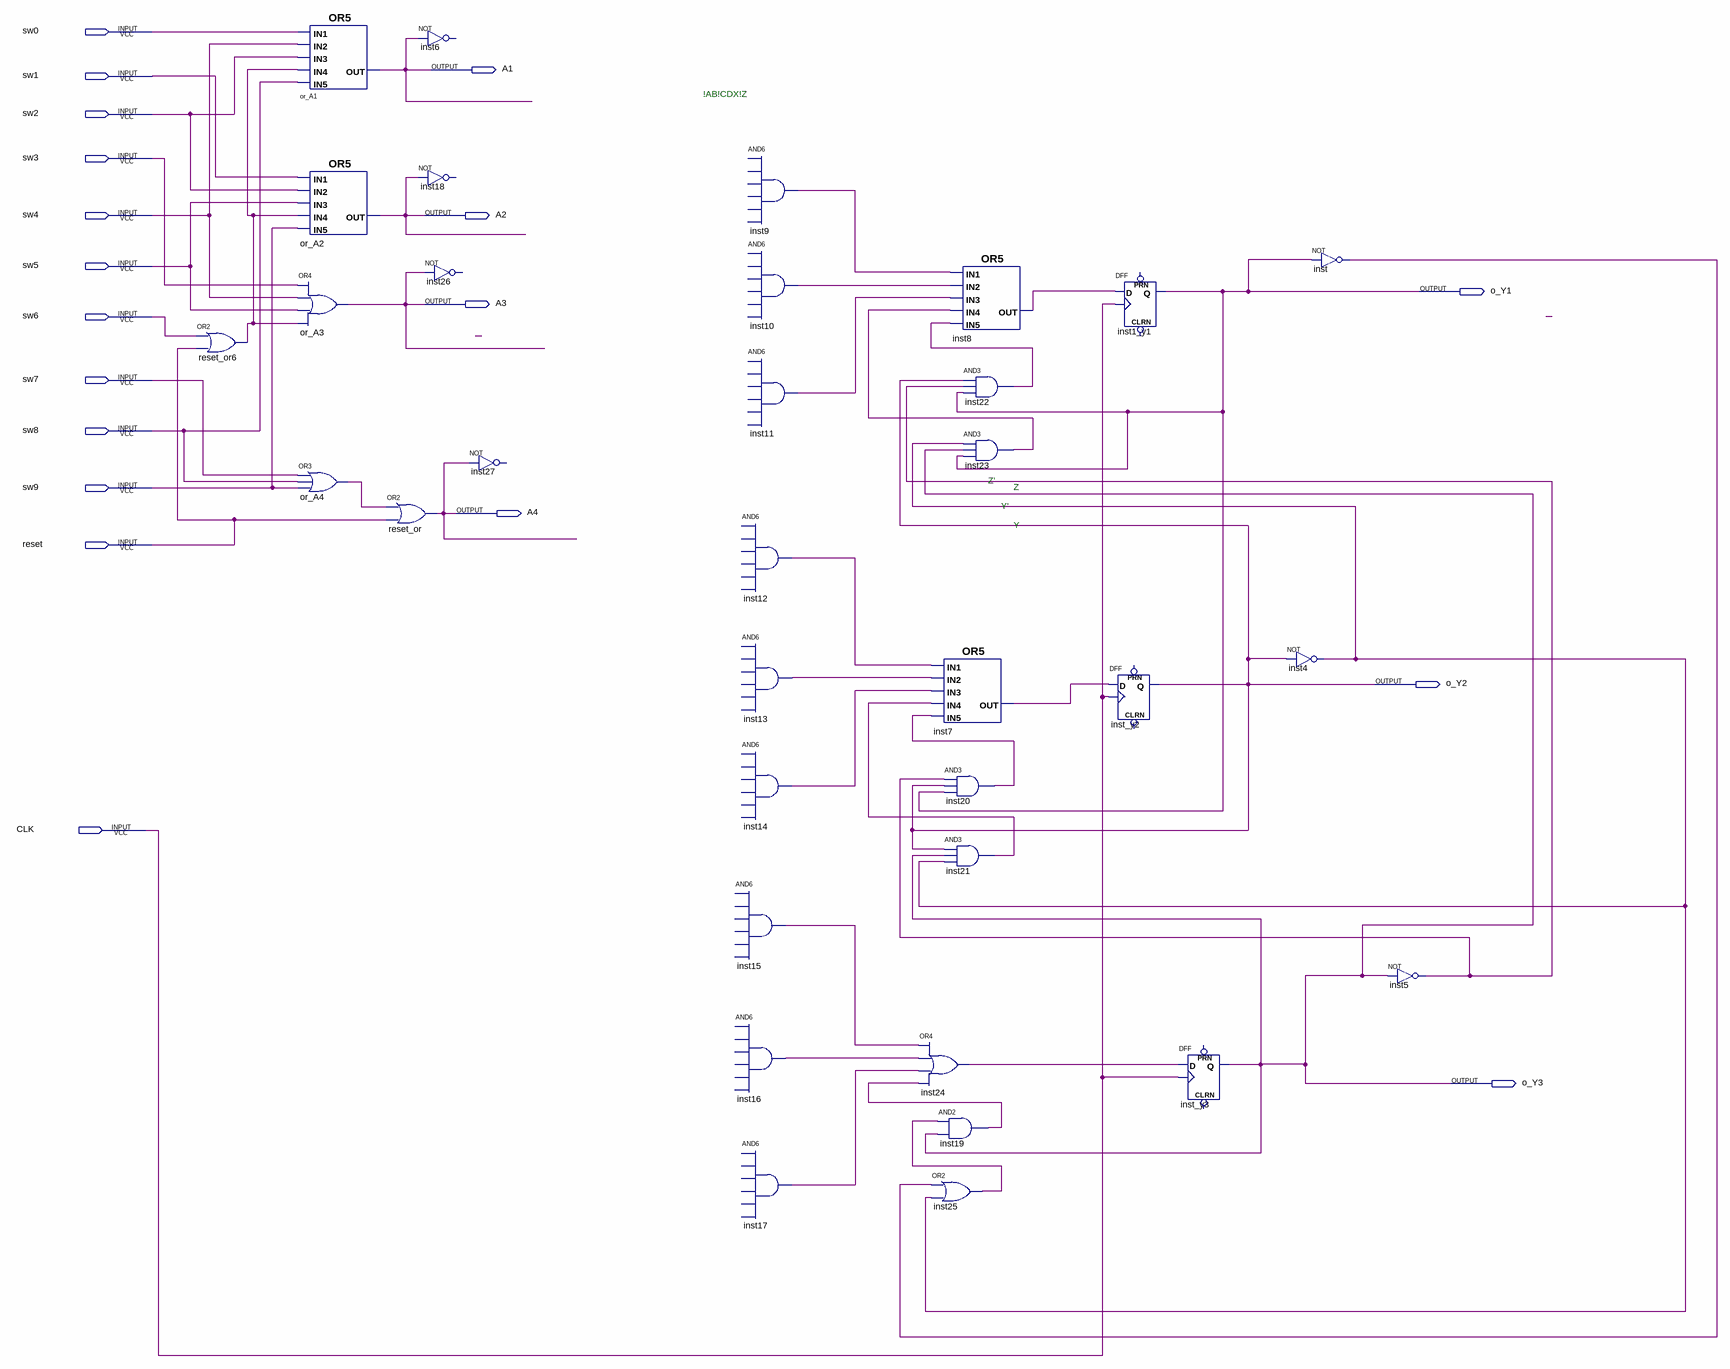
[diagram p0: schematic sheet]
// Quartus schematic look_door_01.bdf as structural Verilog: 34 symbols, 19 pins
module look_door_01 (
  input  sw0,
  input  sw1,
  input  sw2,
  input  sw3,
  input  sw4,
  input  sw5,
  input  sw6,
  input  sw7,
  input  sw8,
  input  sw9,
  input  reset,
  input  CLK,
  output A1,
  output A2,
  output o_Y1,
  output A3,
  output A4,
  output o_Y2,
  output o_Y3
);

  wire inst4_out, inst5_out, inst7_out, inst8_out, inst9_out, inst10_out, inst11_out, inst12_out, inst13_out,
       inst14_out, inst15_out, inst16_out, inst17_out, inst19_out, inst20_out, inst21_out, inst22_out,
       inst23_out, inst24_out, inst25_out, inst_out, or_A4_out, reset_or6_out;

  or reset_or6 (reset_or6_out, sw6, reset);
  or or_A1 (A1, sw0, sw4, sw2, reset_or6_out, sw8);
  or or_A2 (A2, sw1, sw2, sw5, reset_or6_out, sw9);
  or or_A3 (A3, sw3, sw4, sw5, reset_or6_out);
  or or_A4 (or_A4_out, sw7, sw8, sw9);
  or reset_or (A4, or_A4_out, reset);
  // NOT inst6 has open pins: IN=A1, OUT=open
  // NOT inst18 has open pins: IN=A2, OUT=open
  // NOT inst26 has open pins: IN=A3, OUT=open
  // NOT inst27 has open pins: IN=A4, OUT=open
  // AND6 inst9 has open pins: IN1=open, IN2=open, IN3=open, IN4=open, IN5=open, IN6=open, OUT=inst9_out
  // AND6 inst10 has open pins: IN1=open, IN2=open, IN3=open, IN4=open, IN5=open, IN6=open, OUT=inst10_out
  // AND6 inst11 has open pins: IN1=open, IN2=open, IN3=open, IN4=open, IN5=open, IN6=open, OUT=inst11_out
  // AND6 inst12 has open pins: IN1=open, IN2=open, IN3=open, IN4=open, IN5=open, IN6=open, OUT=inst12_out
  // AND6 inst13 has open pins: IN1=open, IN2=open, IN3=open, IN4=open, IN5=open, IN6=open, OUT=inst13_out
  // AND6 inst14 has open pins: IN1=open, IN2=open, IN3=open, IN4=open, IN5=open, IN6=open, OUT=inst14_out
  // AND6 inst15 has open pins: IN1=open, IN2=open, IN3=open, IN4=open, IN5=open, IN6=open, OUT=inst15_out
  // AND6 inst16 has open pins: IN1=open, IN2=open, IN3=open, IN4=open, IN5=open, IN6=open, OUT=inst16_out
  // AND6 inst17 has open pins: IN1=open, IN2=open, IN3=open, IN4=open, IN5=open, IN6=open, OUT=inst17_out
  or inst8 (inst8_out, inst9_out, inst10_out, inst11_out, inst23_out, inst22_out);
  or inst7 (inst7_out, inst12_out, inst13_out, inst14_out, inst21_out, inst20_out);
  and inst20 (inst20_out, inst5_out, o_Y2, o_Y1);
  and inst21 (inst21_out, o_Y2, o_Y3, inst4_out);
  or inst24 (inst24_out, inst15_out, inst16_out, inst17_out, inst19_out);
  and inst19 (inst19_out, inst25_out, o_Y3);
  or inst25 (inst25_out, inst_out, inst4_out);
  and inst22 (inst22_out, o_Y2, inst5_out, o_Y1);
  and inst23 (inst23_out, inst4_out, o_Y3, o_Y1);
  DFF inst_y2 (.CLK(CLK), .D(inst7_out), .Q(o_Y2));  // open: CLRN, PRN
  DFF inst1_y1 (.CLK(CLK), .D(inst8_out), .Q(o_Y1));  // open: CLRN, PRN
  DFF inst_y3 (.CLK(CLK), .D(inst24_out), .Q(o_Y3));  // open: CLRN, PRN
  not inst (inst_out, o_Y1);
  not inst4 (inst4_out, o_Y2);
  not inst5 (inst5_out, o_Y3);

  // Notes on the sheet:
  //   !AB!CDX!Z
  //   Z'
  //   Z
  //   Y'
  //   Y
endmodule
